# EAGLE design LEDBOARD_v1 (EAGLE 9.0.0)
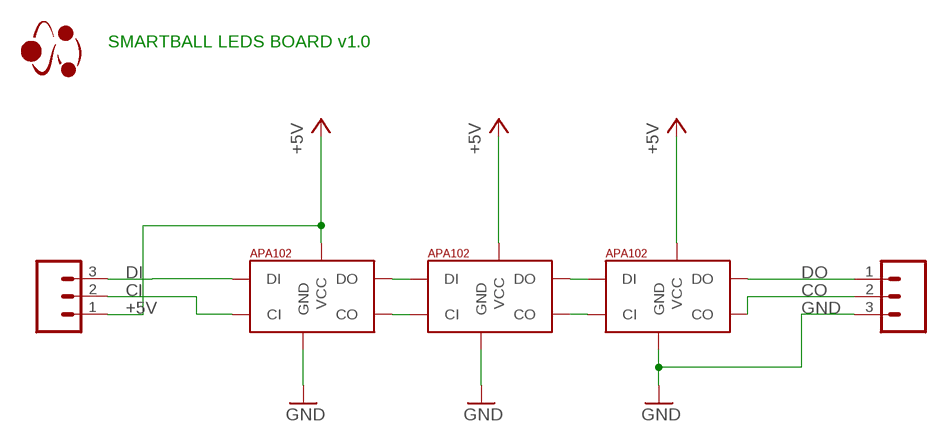
[diagram p0: schematic, sheet 1]

## Parts
U$1  APA102  [APA102_5050_SB]
U$2  APA102  [APA102_5050_SB]
U$3  APA102  [APA102_5050_SB]
U$4  LOGO_SMARTBALL  [SMARTBALL_LOGO]
U$5  CONN_03_SMDCONN03_SMD_MALE  [CONN03_SMD_MALE]
U$6  CONN_03_SMDCONN03_SMD_MALE  [CONN03_SMD_MALE]

## Nets
+5V: U$1.VCC U$2.VCC U$3.VCC U$5.1
CI: U$1.CI U$1.CI2(CI) U$5.2
CO: U$3.CO U$6.2
DI: U$1.DI U$1.DI2(DI) U$5.3
DO: U$3.DO U$6.1
GND: U$1.GND U$1.GND2(GND) U$2.GND U$2.GND2(GND) U$3.GND U$3.GND2(GND) U$6.3
N$7: U$1.DO U$2.DI U$2.DI2(DI)
N$8: U$1.CO U$2.CI U$2.CI2(CI)
N$9: U$2.DO U$3.DI U$3.DI2(DI)
N$10: U$2.CO U$3.CI U$3.CI2(CI)

## Notes on the sheet
- SMARTBALL LEDS BOARD v1.0

## Library data of the parts
U$1-U$3 = Smartball:APA102: APA102C 5050 RGB LED -- Adafruit DotStar Single LED Pixel Product Page: https://www.adafruit.com/products/2343 Datasheet: https://cdn-shop.adafruit.com/product-files/2343/APA102C.pdf
U$4 = Smartball:LOGO_SMARTBALL
U$5 U$6 = Smartball:CONN_03_SMD

## Net classes
0 default: width 0.152 mm
1 power: width 0.254 mm

## Board
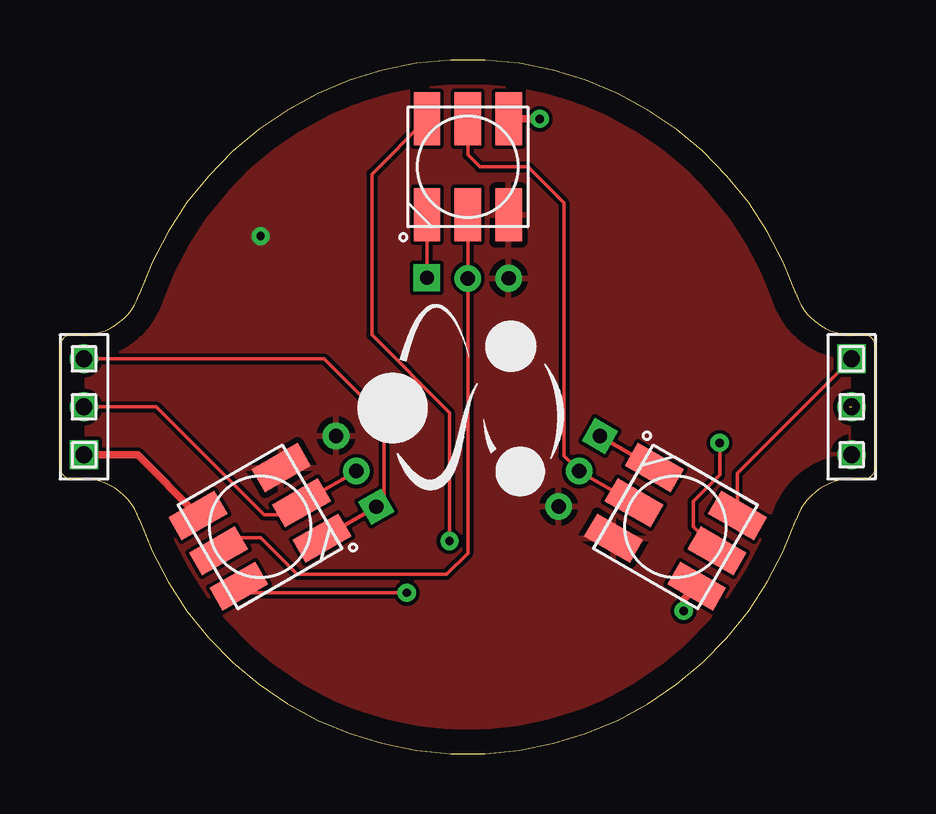
[diagram p1: board, top side]
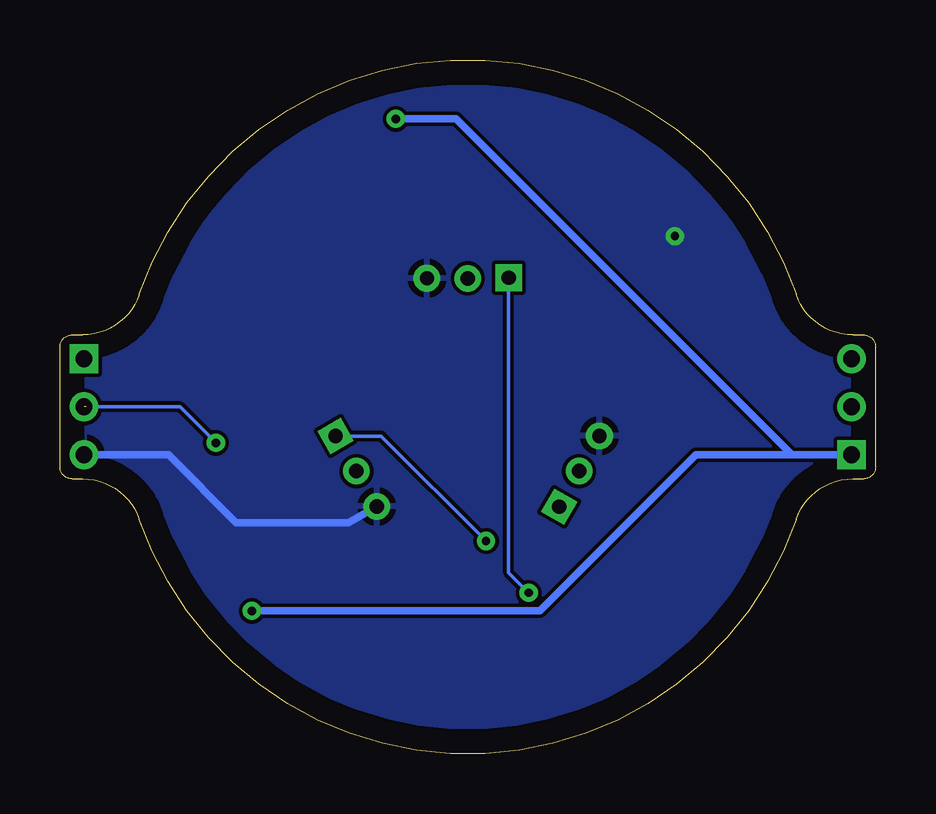
[diagram p2: board, bottom side, seen from below]

Size 34 x 28.9 mm. Coordinates in mm from the lower left corner, seen from the top.
Outline: 33.5,11.45 33.05,11.45 arc71 30.69,9.76 arc-142 3.31,9.76 arc71 0.95,11.45 0.5,11.45 arc-90 0,11.95 0,16.95 arc-90 0.5,17.45 0.95,17.45 arc71 3.31,19.14 arc-142 30.69,19.14 arc71 33.05,17.45 33.5,17.45 arc-90 34,16.95 34,11.95 arc-90 33.5,11.45
Copper layers (1*16): Top 0.035mm / dielectric 1.5mm / Bottom 0.035mm
Design rules "default": minimum track width 6mil, minimum drill 0.35mm, track to track 6mil, track to pad 6mil, pad to pad 6mil, via to via 6mil, smd to smd 6mil, copper to edge 40mil, drill to drill 6mil, minimum pad ring 10mil, minimum via ring 8mil, stop-mask expansion 4mil, vias tented up to drill 0mil, thermal gap 10mil

### Footprints (pad centres in the part's own frame; a part is rotated, then mirrored left to right if it is on the bottom)
APA102_5050_SB = smd 2.2 x 1.1: CI -2,0; CO 2,0; DI -2,1.7; DO 2,1.7; GND -2,-1.7; VCC 2,-1.7 | drill 0.6: CI2 -4.645,0; GND2 -4.642,-1.7 | drill 0.6 square: DI2 -4.62,1.7
CONN03_SMD_MALE = drill 0.7 square: 1 -2,0 | drill 0.7: 2 0,0; 3 2,0

### Placement (x,y rotation side)
U$1  8.34,9.45 210 top
U$2  17,24.45 90 top
U$3  25.66,9.45 330 top
U$4  17,14.2 0 top
U$5  1,14.45 90 top
U$6  33,14.45 270 top

### Tracks (layer width: path | path; a pad name or v marks a point on that pad's centre or on a via)
+5V  (via drill 0.35)
  Top 0.305: U$5.1 3.23,12.45 U$1.VCC | v20,26.45 U$2.VCC | v26,5.95 26,6.44 U$3.VCC
  Bottom 0.305: v20,26.45 17.5,26.45 17,25.95 3.5,12.45 U$5.1 7.5,12.45 14,5.95 v26,5.95
CI
  Top 0.152: U$5.2 4,14.45 8.5,9.95 9.57,9.95 U$1.CI U$1.CI2
CO  (via drill 0.35)  (1 unrouted)
  Top 0.152: U$3.CO 26.4,9.45 26.4,10.52 27.5,11.62 v27.5,12.95
  Bottom 0.152: v27.5,12.95 29,14.45 32.91,14.45
DI
  Top 0.152: U$1.DI U$1.DI2 13.5,10.6 13.5,13.95 11,16.45 U$5.3
DO
  Top 0.152: U$3.DO 28.24,11.69 U$6.1
GND  (via drill 0.35)
  Bottom 0.305: U$6.3 29.48,12.45 26.65,9.63 21.97,9.63 U$3.GND2
  other vias: 8.36,21.56
  pour Bottom: -0.5,31.95 -0.5,-3.05 34.5,-3.05 34.5,31.95
  pour Top: -0.5,31.95 -0.5,-3.05 34.5,-3.05 34.5,31.95
N$7  (via drill 0.35)
  Top 0.152: U$2.DI U$2.DI2 | U$1.DO 7.73,6.71 v14.46,6.71
  Bottom 0.152: v14.46,6.71 15.3,7.55 U$2.DI2
N$8
  Top 0.152: U$2.CI U$2.CI2 17,8.36 16.11,7.47 9.89,7.47 8.36,8.99 7.15,8.99 U$1.CO
N$9  (via drill 0.35)
  Top 0.152: U$3.DI U$3.DI2 | U$2.DO 13,24.15 13,17.45 16.24,14.21 v16.24,8.86
  Bottom 0.152: v16.24,8.86 20.61,13.23 U$3.DI2
N$10
  Top 0.152: U$3.CI U$3.CI2 21,12.41 21,22.95 19.5,24.45 17.5,24.45 17,24.95 U$2.CO